# EAGLE design strobocops_v4_chipswitch (EAGLE 8.7.1)
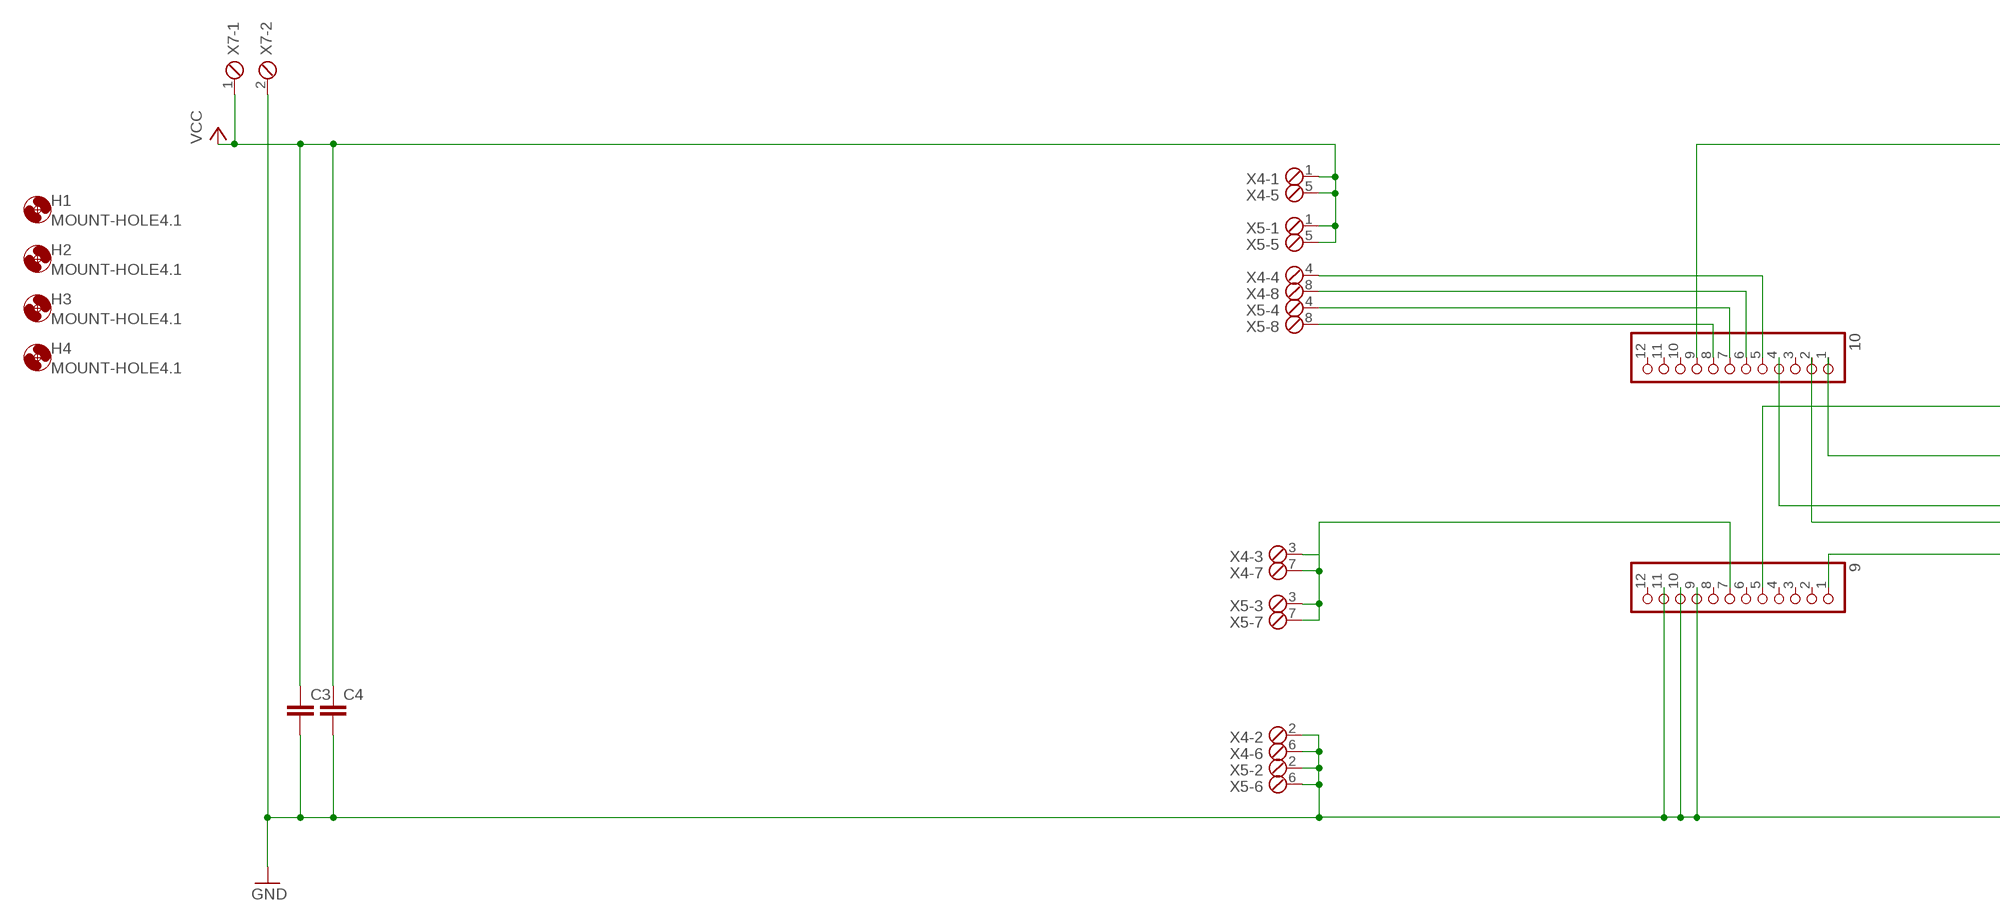
[diagram p0: schematic, sheet 1, part 1 of 2]
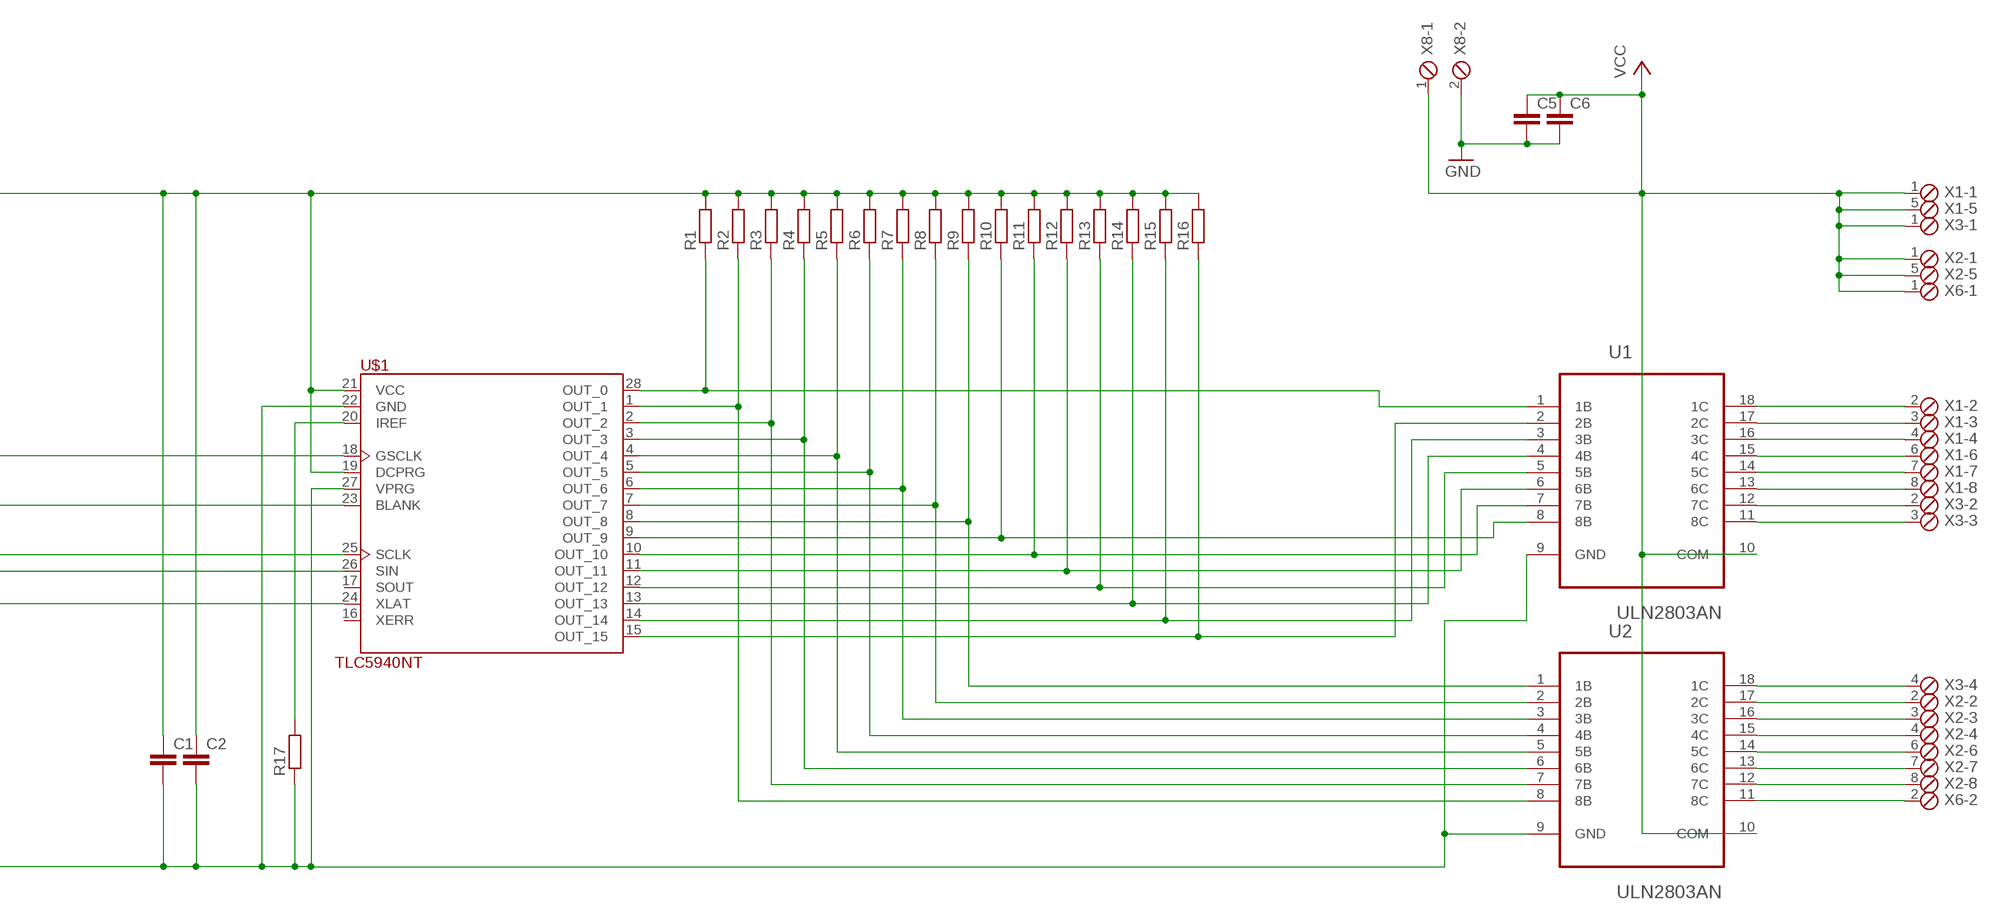
[diagram p1: schematic, sheet 1, part 2 of 2]

## Parts
9  PINHD-1X12-CB  [1X12-CB]
10  PINHD-1X12-CB  [1X12-CB]
C1  C-EU050-025X075  [C050-025X075]
C2  C-EU050-025X075  [C050-025X075]
C3  C-EU050-025X075  [C050-025X075]
C4  C-EU050-025X075  [C050-025X075]
C5  C-EU050-025X075  [C050-025X075]
C6  C-EU050-025X075  [C050-025X075]
H1  MOUNT-HOLE4.1  [4,1]
H2  MOUNT-HOLE4.1  [4,1]
H3  MOUNT-HOLE4.1  [4,1]
H4  MOUNT-HOLE4.1  [4,1]
R1  R-EU_VMTA55  [VMTA55]
R2  R-EU_VMTA55  [VMTA55]
R3  R-EU_VMTA55  [VMTA55]
R4  R-EU_VMTA55  [VMTA55]
R5  R-EU_VMTA55  [VMTA55]
R6  R-EU_VMTA55  [VMTA55]
R7  R-EU_VMTA55  [VMTA55]
R8  R-EU_VTA56  [VTA56]
R9  R-EU_VTA56  [VTA56]
R10  R-EU_VTA56  [VTA56]
R11  R-EU_VTA56  [VTA56]
R12  R-EU_VMTA55  [VMTA55]
R13  R-EU_VMTA55  [VMTA55]
R14  R-EU_VMTA55  [VMTA55]
R15  R-EU_VMTA55  [VMTA55]
R16  R-EU_VMTA55  [VMTA55]
R17  R-EU_VMTA55  [VMTA55]
U1  ULN2803AN  [DIP254P762X393-18]
U2  ULN2803AN  [DIP254P762X393-18]
U$1  TLC5940NT  [DIP-28]
X1  MPT8  [8POL254]
X2  MPT8  [8POL254]
X3  MPT4  [4POL254]
X4  MPT8  [8POL254]
X5  MPT8  [8POL254]
X6  MPT2  [2POL254]
X7  MPT2  [2POL254]
X8  MPT2  [2POL254]

## Nets
GND: 9.9 9.10 9.11 C1.2 C2.2 C3.2 C4.2 C5.2 C6.2 R17.1 U1.9(GND) U2.9(GND) U$1.22(GND) U$1.27(VPRG) X4.2 X4.6 X5.2 X5.6 X7.2 X8.2
N$1: 10.2 U$1.26(SIN)
N$2: 9.5 U$1.18(GSCLK)
N$3: 9.1 U$1.24(XLAT)
N$4: 10.1 U$1.23(BLANK)
N$5: 10.5 X4.4
N$6: R2.1 U2.8(8B) U$1.1(OUT_1)
N$7: R3.1 U2.7(7B) U$1.2(OUT_2)
N$8: R4.1 U2.6(6B) U$1.3(OUT_3)
N$9: R5.1 U2.5(5B) U$1.4(OUT_4)
N$10: R6.1 U2.4(4B) U$1.5(OUT_5)
N$11: R7.1 U2.3(3B) U$1.6(OUT_6)
N$12: R8.1 U2.2(2B) U$1.7(OUT_7)
N$13: R9.1 U2.1(1B) U$1.8(OUT_8)
N$14: U1.14(5C) X1.7
N$15: U1.18(1C) X1.2
N$16: U1.17(2C) X1.3
N$17: U1.16(3C) X1.4
N$18: U1.15(4C) X1.6
N$19: U1.13(6C) X1.8
N$20: U1.12(7C) X3.2
N$21: U1.11(8C) X3.3
N$22: U2.18(1C) X3.4
N$23: R14.1 U1.4(4B) U$1.13(OUT_13)
N$24: U2.17(2C) X2.2
N$25: U2.16(3C) X2.3
N$26: U2.15(4C) X2.4
N$27: U2.14(5C) X2.6
N$28: U2.13(6C) X2.7
N$29: U2.12(7C) X2.8
N$30: R10.1 U1.8(8B) U$1.9(OUT_9)
N$31: R11.1 U1.7(7B) U$1.10(OUT_10)
N$32: R12.1 U1.6(6B) U$1.11(OUT_11)
N$33: R13.1 U1.5(5B) U$1.12(OUT_12)
N$34: R15.1 U1.3(3B) U$1.14(OUT_14)
N$35: R16.1 U1.2(2B) U$1.15(OUT_15)
N$36: 9.7 X4.3 X4.7 X5.3 X5.7
N$37: 10.6 X4.8
N$38: 10.7 X5.4
N$39: U2.11(8C) X6.2
N$40: 10.8 X5.8
N$41: R17.2 U$1.20(IREF)
N$42: R1.1 U1.1(1B) U$1.28(OUT_0)
N$43: 10.4 U$1.25(SCLK)
VCC_5V: C3.1 C4.1 X4.1 X4.5 X5.1 X5.5 X7.1 ; supply symbol labelled VCC
VCC_12V: C5.1 C6.1 U1.10(COM) U2.10(COM) X1.1 X1.5 X2.1 X2.5 X3.1 X6.1 X8.1 ; supply symbol labelled VCC
VCC_MCU_5V: 10.9 C1.1 C2.1 R1.2 R2.2 R3.2 R4.2 R5.2 R6.2 R7.2 R8.2 R9.2 R10.2 R11.2 R12.2 R13.2 R14.2 R15.2 R16.2 U$1.19(DCPRG) U$1.21(VCC)
Unconnected: 9.2 9.3 9.4 9.6 9.8 9.12 10.3 10.10 10.11 10.12 U$1.16(XERR) U$1.17(SOUT)

## Library data of the parts
9 10 = adafruit:PINHD-1X12: PIN HEADER
C1-C6 = resistor:C-EU: CAPACITOR, European symbol
H1-H4 = holes:MOUNT-HOLE: MOUNTING HOLE with drill center marker
R1-R17 = resistor:R-EU_: RESISTOR, European symbol
U1 U2 = ULN2803A:ULN2803AN: Darlington transistor array; MPN: ULN2803AN; OC_FARNELL: 1652422; OC_NEWARK: 21J9298; PACKAGE: DIP-18; SUPPLIER: TEXAS INSTRUMENTS
U$1 = tlc5940:TLC5940
X1 X2 X4 X5 = con-phoenix-254:MPT8: PHOENIX CONNECTOR; OC_FARNELL: unknown; OC_NEWARK: unknown
X3 = con-phoenix-254:MPT4: PHOENIX CONNECTOR; OC_FARNELL: unknown; OC_NEWARK: unknown
X6-X8 = con-phoenix-254:MPT2: PHOENIX CONNECTOR; OC_FARNELL: unknown; OC_NEWARK: unknown

## Board
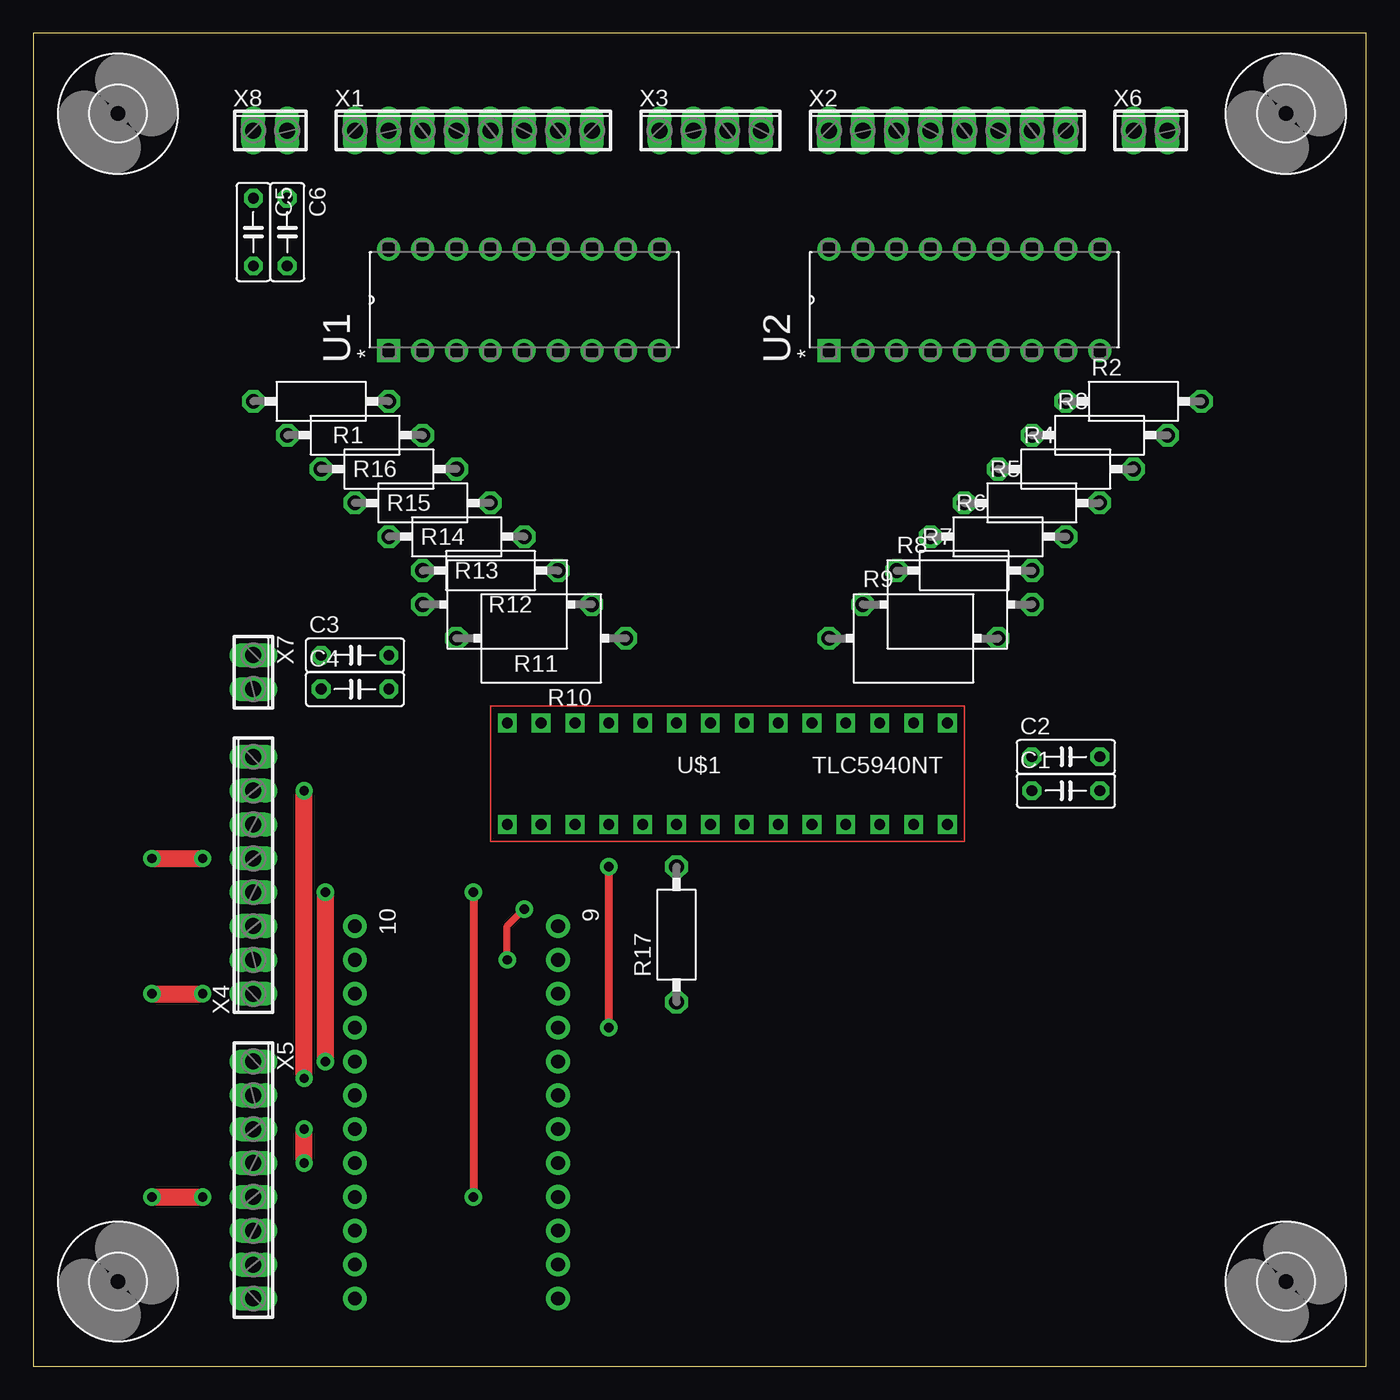
[diagram p2: board, top side]
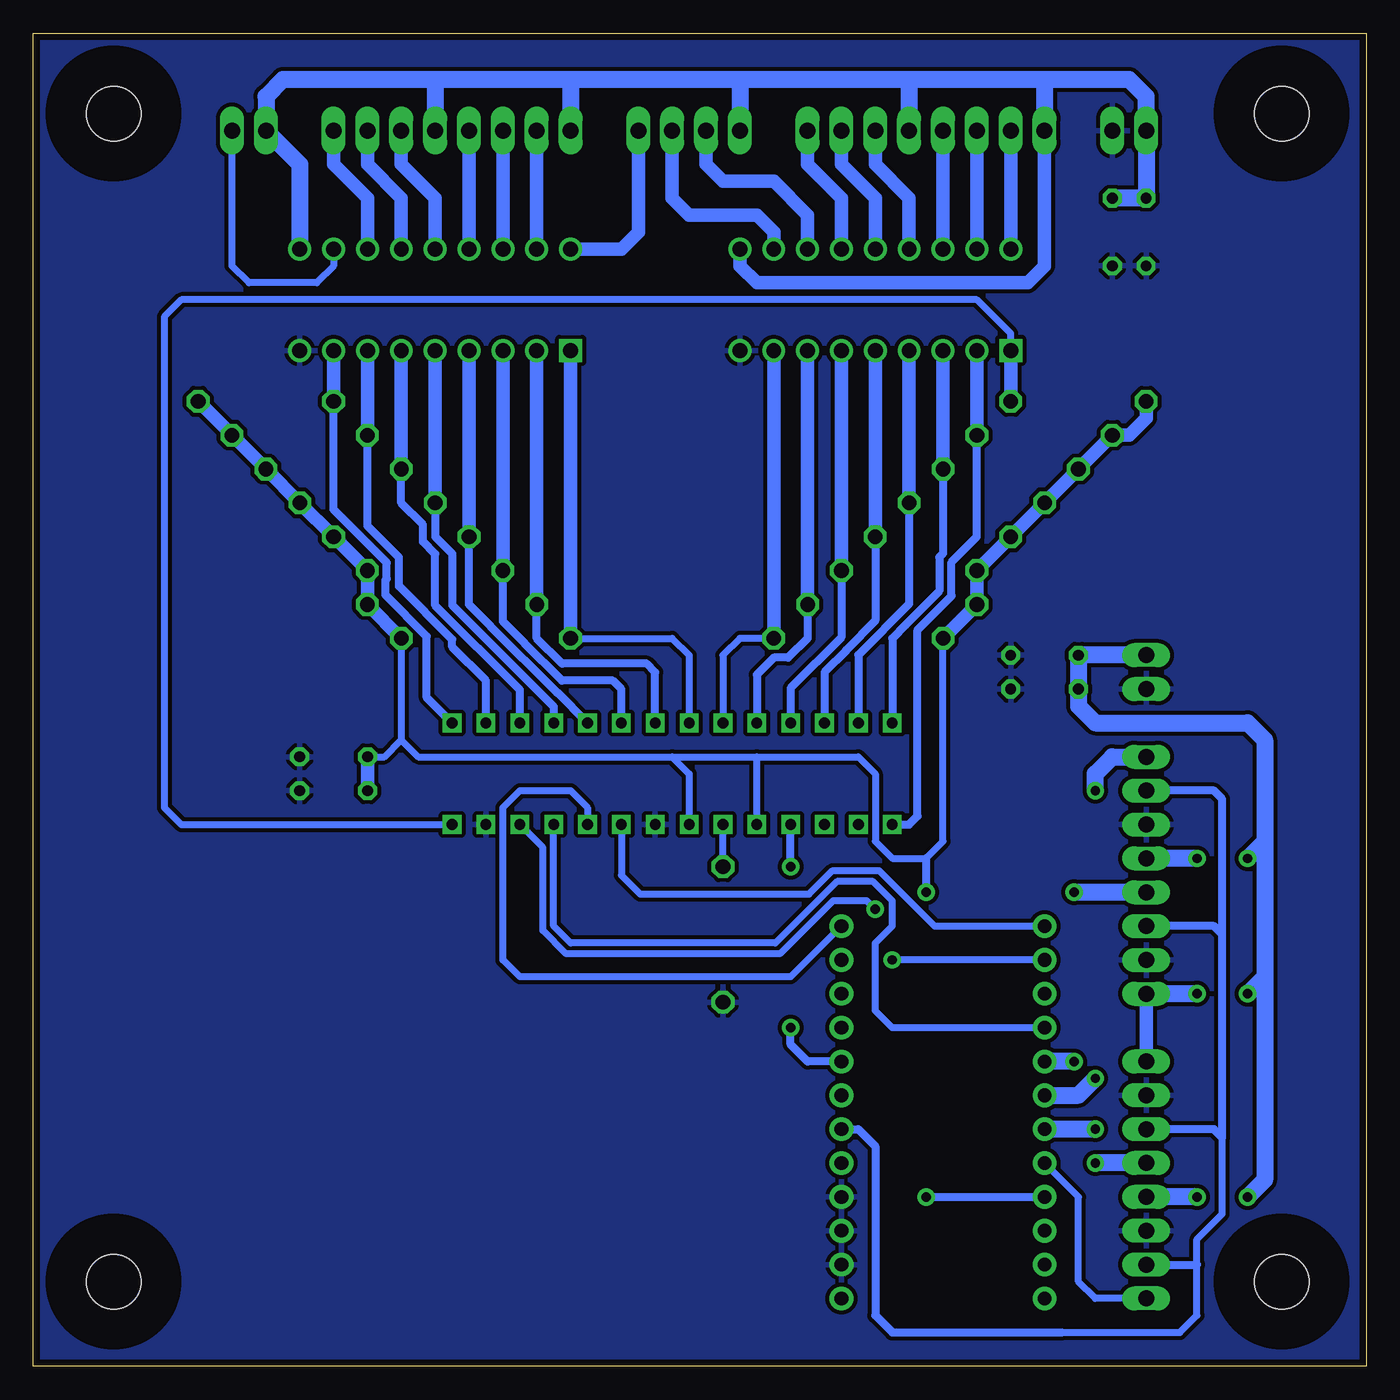
[diagram p3: board, bottom side, seen from below]

Size 100 x 100 mm. Coordinates in mm from the lower left corner, seen from the top.
Outline: 0,0 100,0 100,100 0,100 0,0
Copper layers (1*16): Top 0.035mm / dielectric 1.5mm / Bottom 0.035mm
Design rules "HVA-LPKF": minimum track width 0.3mm, minimum drill 0.6mm, track to track 0.3mm, track to pad 0.3mm, pad to pad 0.3mm, via to via 0.3mm, smd to smd 0.3mm, copper to edge 0.5mm, drill to drill 0.5mm, minimum pad ring 0.3mm, minimum via ring 0.3mm, stop-mask expansion 0.1mm, vias tented up to drill 0mil, thermal gap 0.3mm

### Footprints (pad centres in the part's own frame; a part is rotated, then mirrored left to right if it is on the bottom)
1X12-CB = drill 1.016 pad 1.778: 1 -13.97,0; 2 -11.43,0; 3 -8.89,0; 4 -6.35,0; 5 -3.81,0; 6 -1.27,0; 7 1.27,0; 8 3.81,0; 9 6.35,0; 10 8.89,0; 11 11.43,0; 12 13.97,0
C050-025X075 = drill 0.813 octagon: 1 -2.54,0; 2 2.54,0
4,1 = hole 4.1: 0,0
VMTA55 = drill 1.1 octagon: 1 -5.08,0; 2 5.08,0
VTA56 = drill 1.1 octagon: 1 -6.35,0; 2 6.35,0
DIP254P762X393-18 = drill 1.118 square: 1 -7.62,20.32 | drill 1.118: 2 -7.62,17.78; 3 -7.62,15.24; 4 -7.62,12.7; 5 -7.62,10.16; 6 -7.62,7.62; 7 -7.62,5.08; 8 -7.62,2.54; 9 -7.62,0; 10 0,0; 11 0,2.54; 12 0,5.08; 13 0,7.62; 14 0,10.16; 15 0,12.7; 16 0,15.24; 17 0,17.78; 18 0,20.32
DIP-28 = drill 0.8 square: 1 -3.81,-1.27; 2 -3.81,-3.81; 3 -3.81,-6.35; 4 -3.81,-8.89; 5 -3.81,-11.43; 6 -3.81,-13.97; 7 -3.81,-16.51; 8 -3.81,-19.05; 9 -3.81,-21.59; 10 -3.81,-24.13; 11 -3.81,-26.67; 12 -3.81,-29.21; 13 -3.81,-31.75; 14 -3.81,-34.29; 15 3.81,-34.29; 16 3.81,-31.75; 17 3.81,-29.21; 18 3.81,-26.67; 19 3.81,-24.13; 20 3.81,-21.59; 21 3.81,-19.05; 22 3.81,-16.51; 23 3.81,-13.97; 24 3.81,-11.43; 25 3.81,-8.89; 26 3.81,-6.35; 27 3.81,-3.81; 28 3.81,-1.27
8POL254 = drill 1.2 long: 1 -8.89,0; 2 -6.35,0; 3 -3.81,0; 4 -1.27,0; 5 1.27,0; 6 3.81,0; 7 6.35,0; 8 8.89,0
4POL254 = drill 1.2 long: 1 -3.81,0; 2 -1.27,0; 3 1.27,0; 4 3.81,0
2POL254 = drill 1.2 long: 1 -1.27,0; 2 1.27,0

### Placement (x,y rotation side)
9  39.37,19.05 270 top
10  24.13,19.05 270 top
C1  77.47,43.18 0 top
C2  77.47,45.72 0 top
C3  24.13,53.34 0 top
C4  24.13,50.8 0 top
C5  16.51,85.09 270 top
C6  19.05,85.09 270 top
H1  6.35,93.98 0 top
H2  6.35,6.35 0 top
H3  93.98,6.35 0 top
H4  93.98,93.98 0 top
R1  21.59,72.39 180 top
R2  82.55,72.39 0 top
R3  80.01,69.85 0 top
R4  77.47,67.31 0 top
R5  74.93,64.77 0 top
R6  72.39,62.23 0 top
R7  69.85,59.69 0 top
R8  68.58,57.15 0 top
R9  66.04,54.61 0 top
R10  38.1,54.61 180 top
R11  35.56,57.15 180 top
R12  34.29,59.69 180 top
R13  31.75,62.23 180 top
R14  29.21,64.77 180 top
R15  26.67,67.31 180 top
R16  24.13,69.85 180 top
R17  48.26,32.38 90 top
U1  46.99,83.82 90 top
U2  80.01,83.82 90 top
U$1  69.85,44.45 270 top
X1  33.02,92.71 0 top
X2  68.58,92.71 0 top
X3  50.8,92.71 0 top
X4  16.51,36.83 90 top
X5  16.51,13.97 270 top
X6  83.82,92.71 0 top
X7  16.51,52.07 270 top
X8  17.78,92.71 0 top

### Tracks (layer width: path | path; a pad name or v marks a point on that pad's centre or on a via)
GND
  pour Bottom: 0,0 0,100.33 100.33,100.33 100.33,0
N$1  (via drill 0.7 pad 0.7)
  Top 0.508: v35.56,30.48 35.56,33.02 v36.83,34.29
  Bottom 0.508: 10.2 v35.56,30.48 | v36.83,34.29 37.47,34.92 40.01,34.92 43.99,30.94 60.02,30.94 61.77,32.69 61.77,38.91 U$1.26
N$2  (via drill 0.7 pad 0.75)
  Top 0.61: v43.18,25.4 v43.18,37.47
  Bottom 0.61: 9.5 41.91,22.86 43.18,24.13 v43.18,25.4 | v43.18,37.47 U$1.18
N$3
  Bottom 0.508: 9.1 43.18,29.21 63.5,29.21 64.77,30.48 64.77,41.91 63.5,43.18 59.69,43.18 58.42,41.91 U$1.24
N$4
  Bottom 0.508: U$1.23 55.88,36.83 54.48,35.43 41.79,35.43 40.04,37.18 36.54,37.18 32.38,33.02 10.1
N$5  (via drill 0.7 pad 0.7)
  Top 1.27: v21.91,35.56 v21.91,22.86
  Bottom 1.27: v21.91,22.86 10.5 | X4.4 v21.91,35.56
N$6
  Bottom 0.61: U$1.1 70.48,50.16 70.48,54.76 73.58,57.86 73.58,58.98 73.47,59.09 73.47,60.29 77.47,64.29 R2.1
  Bottom 1.016: U2.8 R2.1
N$7
  Bottom 0.61: U$1.2 66.04,51.44 68.58,53.98 68.58,54.53 72.57,58.51 72.57,60.67 74.93,63.03 R3.1
  Bottom 1.016: U2.7 R3.1
N$8
  Bottom 0.61: U$1.3 63.5,50.73 69.85,57.09 69.85,60.94 70.76,61.85 70.76,63.14 72.39,64.77 R4.1
  Bottom 1.016: U2.6 R4.1
N$9
  Bottom 0.61: R5.1 69.85,62.23 68.58,60.96 68.58,57.1 60.96,49.48 U$1.4
  Bottom 1.016: U2.5 R5.1
N$10
  Bottom 0.61: U$1.5 60.69,50.52 60.72,50.52 65.68,55.49 65.68,55.52 67.31,57.15 R6.1
  Bottom 1.016: U2.4 R6.1
N$11
  Bottom 0.61: U$1.6 55.88,50.8 56.52,51.44 60.34,51.44 63.14,54.23 63.14,54.25 64.77,55.88 R7.1
  Bottom 1.016: U2.3 R7.1
N$12
  Bottom 0.61: U$1.7 53.34,52.07 53.98,52.7 60.33,52.7 62.23,54.61 R8.1
  Bottom 1.016: U2.2 R8.1
N$13
  Bottom 0.508: R9.1 52.07,54.61 50.8,53.34 U$1.8
  Bottom 1.016: R9.1 U2.1
N$14
  Bottom 1.016: U1.14 36.83,87.63 39.37,90.17 X1.7
N$15
  Bottom 1.016: U1.18 X1.2
N$16
  Bottom 1.016: U1.17 X1.3
N$17
  Bottom 1.016: U1.16 X1.4
N$18
  Bottom 1.016: U1.15 34.29,87.63 36.83,90.17 X1.6
N$19
  Bottom 1.016: U1.13 39.37,87.63 41.91,90.17 X1.8
N$20
  Bottom 1.016: U1.12 41.91,86.36 44.45,88.9 48.26,88.9 49.53,90.17 X3.2
N$21
  Bottom 1.016: U1.11 44.45,85.09 45.72,86.36 50.8,86.36 52.07,87.63 X3.3
N$22
  Bottom 1.016: X3.4 54.61,85.09 55.88,83.82 U2.18
N$23
  Bottom 0.61: R14.1 34.29,57.18 38.1,53.37 U$1.13
  Bottom 1.016: U1.4 R14.1
N$24
  Bottom 1.016: X2.2 U2.17
N$25
  Bottom 1.016: X2.3 U2.16
N$26
  Bottom 1.016: X2.4 U2.15
N$27
  Bottom 1.016: U2.14 69.85,87.63 72.39,90.17 X2.6
N$28
  Bottom 1.016: U2.13 72.39,87.63 74.93,90.17 X2.7
N$29
  Bottom 1.016: U2.12 74.93,87.63 77.47,90.17 X2.8
N$30
  Bottom 0.508: R10.1 46.99,54.61 48.26,53.34 U$1.9
  Bottom 1.016: U1.8 R10.1
N$31
  Bottom 0.61: R11.1 41.91,54.61 43.37,53.16 44.45,53.16 45.72,51.88 U$1.10
  Bottom 1.016: U1.7 R11.1
N$32
  Bottom 0.61: R12.1 39.37,54.67 43.18,50.87 U$1.11
  Bottom 1.016: U1.6 R12.1
N$33
  Bottom 0.61: R13.1 36.83,55.93 39.01,53.75 39.01,53.7 40.64,52.07 U$1.12
  Bottom 1.016: U1.5 R13.1
N$34
  Bottom 0.61: R15.1 31.75,60.98 32.02,60.7 32.02,58.16 34.56,55.62 34.56,55.6 35.56,54.61 U$1.14
  Bottom 1.016: U1.3 R15.1
N$35
  Bottom 0.61: U$1.15 34.29,40.64 33.66,41.27 33.66,55.24 31.11,57.78 31.11,60.33 29.21,62.23 R16.1
  Bottom 1.016: R16.1 U1.2
N$36
  Bottom 0.508: 22.86,2.54 13.97,2.54 12.7,3.81 12.7,7.62 12.7,9.53 10.79,11.43 10.79,17.14
  Bottom 0.61: X5.7 12.7,7.62 | X5.3 11.43,17.78 10.79,17.14 10.79,32.38 | 10.79,32.38 11.43,33.02 X4.3 | 10.79,32.38 10.79,42.55 11.43,43.18 X4.7 | 9.7 38.1,17.78 36.83,16.51 36.83,3.81 35.56,2.54 22.86,2.54
N$37  (via drill 0.7 pad 0.7)
  Top 1.27: v20.32,21.59 v20.32,43.18
  Bottom 1.27: 10.6 21.59,20.32 v20.32,21.59 | v20.32,43.18 20.32,44.45 19.05,45.72 X4.8
N$38  (via drill 0.7 pad 0.7)
  Top 1.27: v20.32,15.24 v20.32,17.78
  Bottom 1.27: X5.4 v20.32,15.24 | v20.32,17.78 10.7
N$39
  Bottom 0.508: U2.11 77.47,82.55 78.74,81.28 83.82,81.28 85.09,82.55 X6.2
N$40
  Bottom 0.508: X5.8 20.32,5.08 21.59,6.35 21.59,12.7 10.8
N$41
  Bottom 0.508: R17.2 U$1.20
N$42
  Bottom 0.508: U1.1 26.67,77.47 29.21,80.01 88.9,80.01 90.17,78.74 90.17,41.91 88.9,40.64 U$1.28
  Bottom 1.016: R1.1 U1.1
N$43
  Bottom 0.508: 10.4 27.94,25.4 35.56,25.4 36.83,26.67 36.83,31.75 35.56,33.02 35.56,34.92 37,36.37 39.7,36.37 44.32,31.75 59.69,31.75 60.96,33.02 U$1.25
VCC_5V  (via drill 0.7 pad 0.7)
  Top 1.27: v8.89,38.1 v12.7,38.1 | v8.89,27.94 v12.7,27.94 | v8.89,12.7 v12.7,12.7
  Bottom 1.016: X4.1 X5.1
  Bottom 1.27: 7.62,39.37 v8.89,38.1 | v12.7,38.1 X4.5 | 7.62,39.37 7.62,29.21 | 7.62,29.21 v8.89,27.94 | v12.7,27.94 X4.1 | 7.62,29.21 7.62,13.97 v8.89,12.7 | v12.7,12.7 X5.5 | X7.1 C3.1 C4.1 21.59,49.53 20.32,48.26 8.89,48.26 7.62,46.99 7.62,39.37
VCC_12V
  Bottom 1.016: U1.10 46.99,82.55 45.72,81.28 25.4,81.28 24.13,82.55 X1.1
  Bottom 1.27: 24.13,96.52 17.78,96.52 16.51,95.25 X8.1 C5.1 C6.1 | 24.13,96.52 X1.1 | 24.13,96.52 34.29,96.52 | 34.29,96.52 X1.5 | 34.29,96.52 46.99,96.52 | 46.99,96.52 X3.1 | 46.99,96.52 59.69,96.52 | 59.69,96.52 X2.1 | 59.69,96.52 69.85,96.52 | 69.85,96.52 X2.5 | 69.85,96.52 81.28,96.52 82.55,95.25 X6.1 80.01,90.17 U2.10
VCC_MCU_5V  (via drill 0.7 pad 0.75)
  Top 0.61: v33.02,35.56 v33.02,12.7
  Bottom 0.508: R9.2 72.39,46.99 | 72.39,46.99 71.12,45.72 52.07,45.72 | 52.07,45.72 50.8,44.45 U$1.21 | 52.07,45.72 45.72,45.72 | 45.72,45.72 38.1,45.72 36.83,44.45 36.83,39.37 35.56,38.1 33.02,38.1 31.75,39.37 R10.2 | U$1.19 45.72,45.72 | C2.1 73.66,45.72 72.39,46.99
  Bottom 0.61: 33.02,38.1 v33.02,35.56 | v33.02,12.7 10.9
  Bottom 1.016: R1.2 16.51,71.12 17.78,69.85 R16.2 R15.2 R14.2 R13.2 R12.2 R11.2 R10.2 | R2.2 R3.2 R4.2 R5.2 R6.2 R7.2 R8.2 R9.2 | C2.1 C1.1